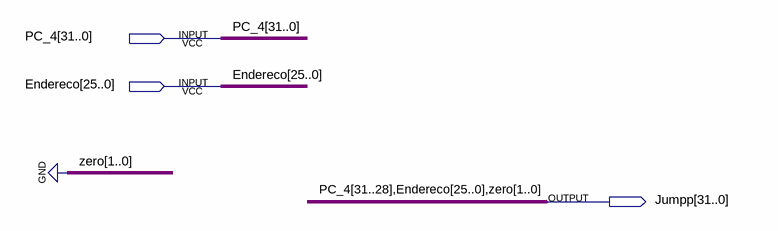
[diagram p0: schematic sheet]
// Quartus schematic Jump.bdf as structural Verilog: 0 symbols, 3 pins
module Jump (
  input  [31:0] PC_4,
  input  [25:0] Endereco,
  output [31:0] Jumpp
);


  assign Jumpp = {PC_4[31:28], Endereco, 2'b00};
endmodule
